# EAGLE design chujograj (EAGLE 8.2.2)
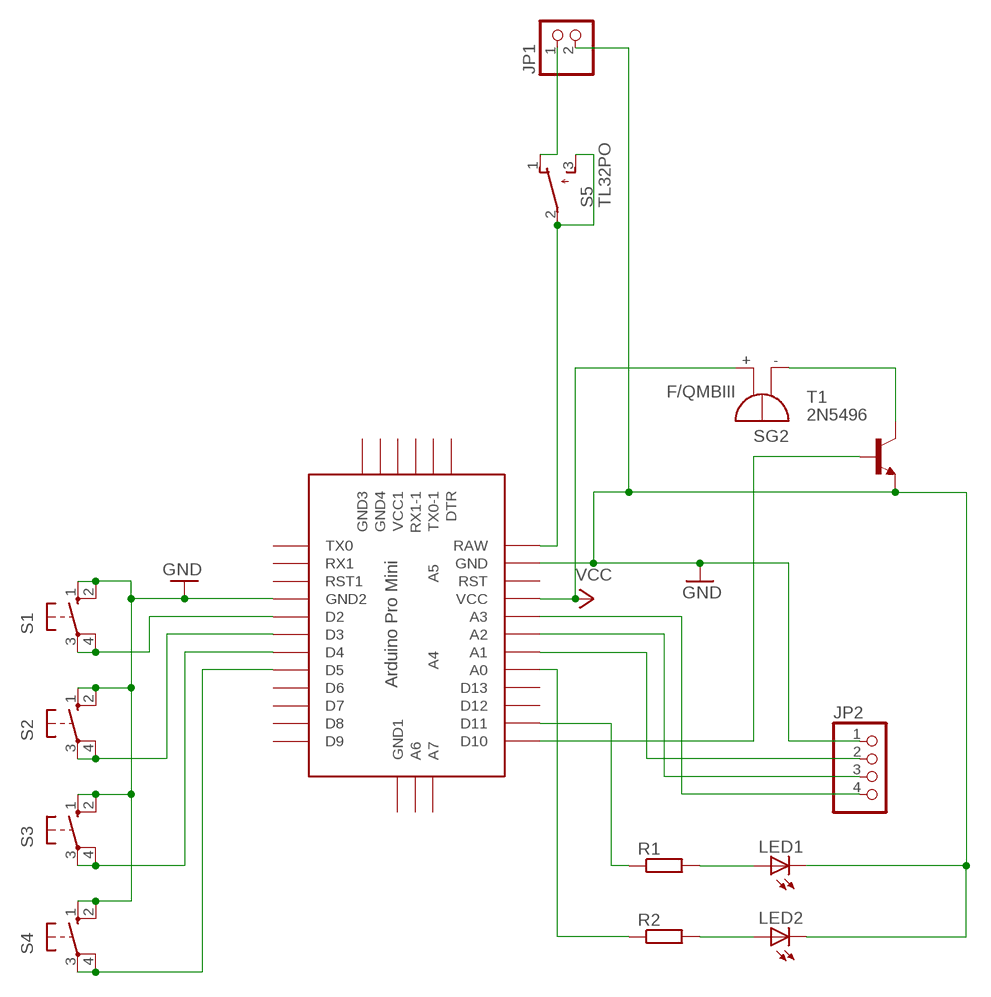
[diagram p0: schematic, sheet 1]

## Parts
JP1  PINHD-1X2  [1X02]
JP2  PINHD-1X4  [1X04]
LED1  LED5MM  [LED5MM]
LED2  LED5MM  [LED5MM]
R1  R-EU_0207/10  [0207/10]
R2  R-EU_0207/10  [0207/10]
S1  40-XX  [B3F-40XX]
S2  40-XX  [B3F-40XX]
S3  40-XX  [B3F-40XX]
S4  40-XX  [B3F-40XX]
S5  TL32PO  [TL3XPO]
SG2  F/QMBIII  [F/QMBIII]
T1  2N5496  [TO220]
U$1  ABK-PRO-MINI  [ABK-PRO-MINI]

## Nets
GND: JP1.2 JP2.1 LED1.K(C) LED2.K(C) S1.1(S) S1.2(S1) S2.1(S) S2.2(S1) S3.1(S) S3.2(S1) S4.1(S) S4.2(S1) T1.3(E) U$1.GND U$1.GND1(GND2)
N$2: S1.3(P) S1.4(P1) U$1.D2
N$3: S2.3(P) S2.4(P1) U$1.D3
N$4: S3.3(P) S3.4(P1) U$1.D4
N$5: S4.3(P) S4.4(P1) U$1.D5
N$7: SG2.-(+) T1.2(C)
N$8: T1.1(B) U$1.D10
N$10: JP2.2 U$1.A1
N$11: JP2.3 U$1.A2
N$12: JP2.4 U$1.A3
N$13: R1.1 U$1.D11
N$14: R2.1 U$1.A0
N$15: LED2.A R2.2
N$16: LED1.A R1.2
N$17: S5.2(P) S5.3(S) U$1.RAW
N$18: JP1.1 S5.1(O)
VCC: SG2.+(-) U$1.VCC
Unconnected: U$1.A4 U$1.A5 U$1.A6 U$1.A7 U$1.D6 U$1.D7 U$1.D8 U$1.D9 U$1.D12 U$1.D13 U$1.DTR U$1.GND2(GND3) U$1.GND3(GND4) U$1.GND4(GND1) U$1.RST U$1.RST1 U$1.RX1 U$1.RX1-1 U$1.TX0 U$1.TX0-1 U$1.VCC1

## Library data of the parts
JP1 = pinhead:PINHD-1X2: PIN HEADER
JP2 = pinhead:PINHD-1X4: PIN HEADER
LED1 LED2 = led:LED: LED OSRAM: - CHIPLED LG R971, LG N971, LY N971, LG Q971, LY Q971, LO R971, LY R971 LH N974, LH R974 LS Q976, LO Q976, LY Q976 LO Q996 - Hyper CHIPLED LW Q18S LB Q993, LB Q99A, LB R99A - SideLED LS A670, LO A670, LY A670, LG A670, LP A670 LB A673, LV A673, LT A673, LW A673 LH A674 LY A675 LS A676, LA A676, LO A676, LY A676, LW A676 LS A679, LY A679, LG A679 - Hyper Micro SIDELED® LS Y876, LA Y876, LO Y876, LY Y876 LT Y87S - SmartLED LW L88C, LW L88S LB L89C, LB L89S, LG L890 LS L89K, LO L89K, LY L89K LS L896, LA L896, LO L896, LY L896 - TOPLED LS T670, LO T670, LY T670, LG T670, LP T670 LSG T670, LSP T670, LSY T670, LOP T670, LYG T670 LG T671, LOG T671, LSG T671 LB T673, LV T673, LT T673, LW T673 LH T674 LS T676, LA T676, LO T676, LY T676, LB T676, LH T676, LSB T676, LW T676 LB T67C, LV T67C, LT T67C, LS T67K, LO T67K, LY T67K, LW E67C LS E67B, LA E67B, LO E67B, LY E67B, LB E67C, LV E67C, LT E67C LW T67C LS T679, LY T679, LG T679 LS T770, LO T770, LY T770, LG T770, LP T770 LB T773, LV T773, LT T773, LW T773 LH T774 LS E675, LA E675, LY E675, LS T675 LS T776, LA T776, LO T776, LY T776, LB T776 LHGB T686 LT T68C, LB T68C - Hyper Mini TOPLED® LB M676 - Mini TOPLED Santana® LG M470 LS M47K, LO M47K, LY M47K Source: http://www.osram.convergy.de LUXEON: - LUMILED® LXK2-PW12-R00, LXK2-PW12-S00, LXK2-PW14-U00, LXK2-PW14-V00 LXK2-PM12-R00, LXK2-PM12-S00, LXK2-PM14-U00 LXK2-PE12-Q00, LXK2-PE12-R00, LXK2-PE12-S00, LXK2-PE14-T00, LXK2-PE14-U00 LXK2-PB12-K00, LXK2-PB12-L00, LXK2-PB12-M00, LXK2-PB14-N00, LXK2-PB14-P00, LXK2-PB14-Q00 LXK2-PR12-L00, LXK2-PR12-M00, LXK2-PR14-Q00, LXK2-PR14-R00 LXK2-PD12-Q00, LXK2-PD12-R00, LXK2-PD12-S00 LXK2-PH12-R00, LXK2-PH12-S00 LXK2-PL12-P00, LXK2-PL12-Q00, LXK2-PL12-R00 Source: www.luxeon.com KINGBRIGHT: KA-3528ASYC Source: www.kingbright.com
R1 R2 = resistor:R-EU_: RESISTOR, European symbol
S1-S4 = switch-omron:40-XX: OMRON SWITCH; MF: OMRON COMPONENTS USA; MPN: B3F-4000; OC_FARNELL: 176434; OC_NEWARK: 36K3105
S5 = switch:TL32PO: TINY SWITCH ON - MOM Source: http://www2.produktinfo.conrad.com/datenblaetter/700000-724999/705152-da-01-de-Subminiaturschalter_TL_36YO.pdf
SG2 = buzzer:F/QMBIII: BUZZER Source: Buerklin; OC_FARNELL: unknown; OC_NEWARK: unknown
T1 = transistor-neu-to92:2N5496: NPN TRANSISTOR
U$1 = Arduino-clone:ABK-PRO-MINI: ABK Pro-Mini Arduino Clone

## Net classes
0 default: width 1 mm, drill 1 mm, clearance 1 mm

## Board
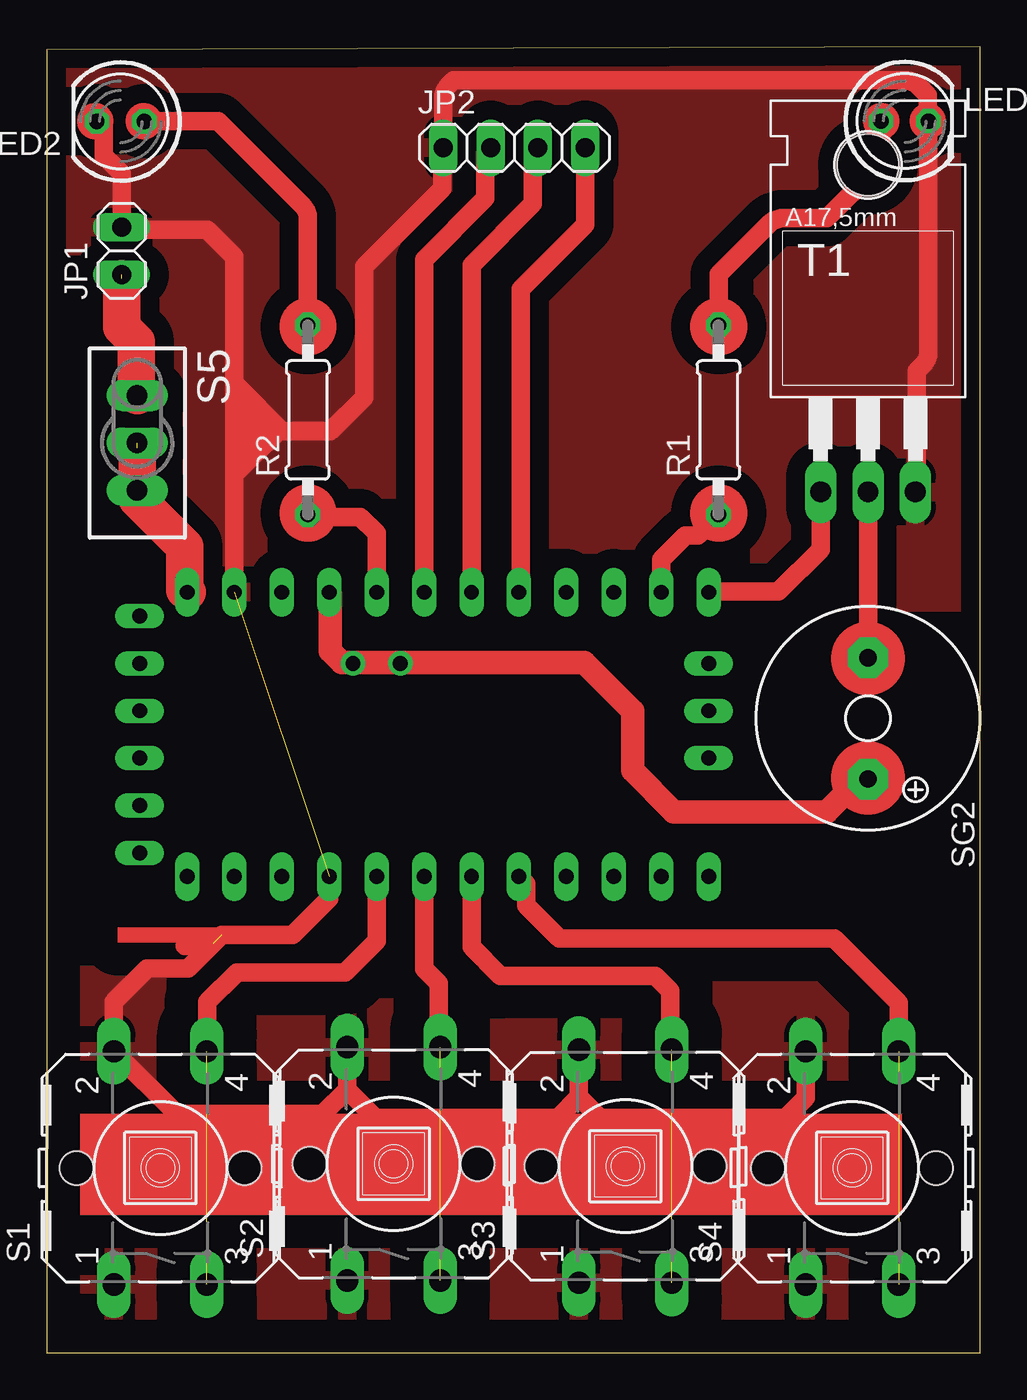
[diagram p1: board, top side]
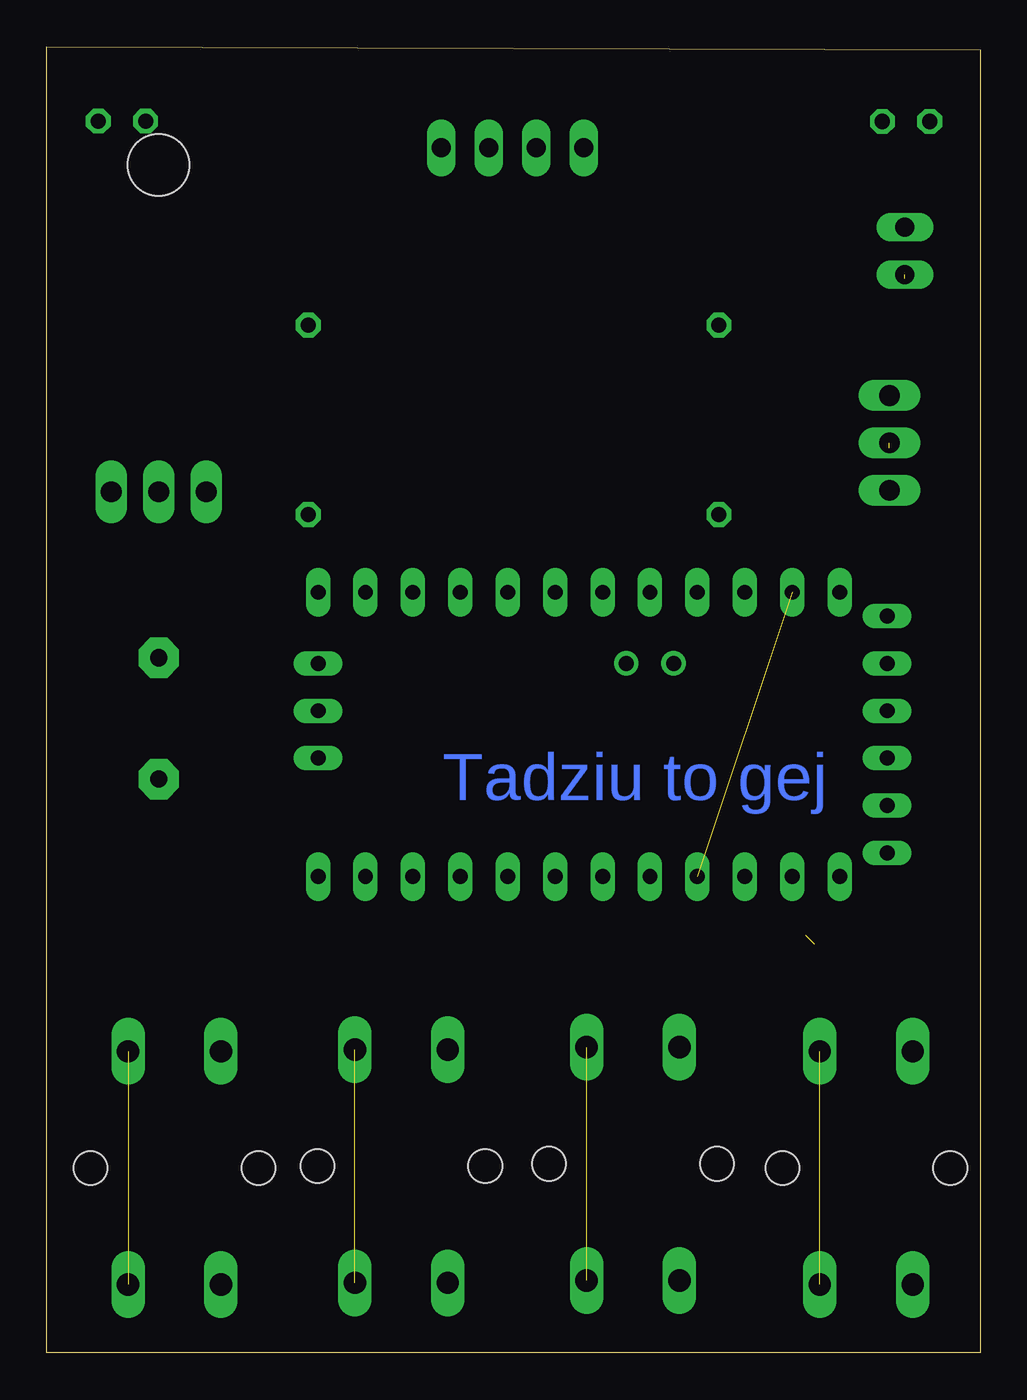
[diagram p2: board, bottom side, seen from below]

Size 50 x 70 mm. Coordinates in mm from the lower left corner, seen from the top.
Outline: 0,0 50,0 50,70 0,69.84 0,0
Copper layers (1*16): Top 0.035mm / dielectric 1.5mm / Bottom 0.035mm
Design rules "default": minimum track width 10mil, minimum drill 24mil, track to track 8mil, track to pad 8mil, pad to pad 8mil, via to via 8mil, smd to smd 8mil, copper to edge 40mil, drill to drill 8mil, minimum pad ring 10mil, minimum via ring 8mil, stop-mask expansion 4mil, vias tented up to drill 0mil, thermal gap 10mil

### Footprints (pad centres in the part's own frame; a part is rotated, then mirrored left to right if it is on the bottom)
1X02 = drill 1.016 long: 1 -1.27,0; 2 1.27,0
1X04 = drill 1.016 long: 1 -3.81,0; 2 -1.27,0; 3 1.27,0; 4 3.81,0
LED5MM = drill 0.813 octagon: A -1.27,0; K 1.27,0
0207/10 = drill 0.813 octagon: 1 -5.08,0; 2 5.08,0
B3F-40XX = drill 1.194 long: 1 -6.248,2.489; 2 6.248,2.489; 3 -6.248,-2.489; 4 6.248,-2.489 | hole 1.803: 0,-4.496; 0,4.496
TL3XPO = drill 1.1 pad 1.422 long: 1 -2.54,0; 2 0,0; 3 2.54,0
F/QMBIII = drill 0.914 pad 2.159 octagon: + 3.251,0; - -3.251,0
TO220 = drill 1.118 long: 1 -2.54,-6.35; 2 0,-6.35; 3 2.54,-6.35 | hole 3.302: 0,11.176
ABK-PRO-MINI = drill 0.8 long: A0 10.16,-3.81; A1 10.16,-6.35; A2 10.16,-8.89; A3 10.16,-11.43; A6 3.81,-21.59; A7 6.35,-21.59; D2 -5.08,-3.81; D3 -5.08,-6.35; D4 -5.08,-8.89; D5 -5.08,-11.43; D6 -5.08,-13.97; D7 -5.08,-16.51; D8 -5.08,-19.05; D9 -5.08,-21.59; D10 10.16,-21.59; D11 10.16,-19.05; D12 10.16,-16.51; D13 10.16,-13.97; DTR 8.89,8.89; GND 10.16,3.81; GND1 -5.08,-1.27; GND2 -3.81,8.89; GND3 -1.27,8.89; GND4 1.27,-21.59; RAW 10.16,6.35; RST 10.16,1.27; RST1 -5.08,1.27; RX1 -5.08,3.81; RX1-1 3.81,8.89; TX0 -5.08,6.35; TX0-1 6.35,8.89; VCC 10.16,-1.27; VCC1 1.27,8.89 | drill 0.8: A4 6.35,-5.08; A5 6.35,-2.54

### Placement (x,y rotation side)
JP1  4.02,59.06 90 top
JP2  25.05,64.58 0 top
LED1  45.97,66.01 0 top
LED2  3.96,65.99 180 top
R1  35.99,50 90 top
R2  13.99,50 90 top
S1  6.09,9.91 90 top
S2  18.59,10.13 90 top
S3  31,10 90 top
S4  43.15,9.91 90 top
S5  4.85,48.76 270 top
SG2  44,34 270 top
T1  44,52.49 0 top
U$1  13.87,30.6 90 top

### Tracks (layer width: path | path; a pad name or v marks a point on that pad's centre or on a via)
GND  (2 unrouted)
  Top 1: T1.3 arc45 46.6,46.28 46.6,52.6 46.95,52.95 arc45 47.24,53.65 LED1.K arc-45 47.2,66.11 47.2,67.4 46.69,67.91 arc45 45.99,68.2 21.8,68.2 21.53,67.93 arc45 21.24,67.23 JP2.1 arc45 21.2,64.48 21.2,62.4 17,58.2 17,51.2 15.2,49.4 12.6,49.4 | LED2.K 3.07,65.61 3.07,64.15 4.02,63.2 JP1.2 4.15,60.2 8.6,60.2 10.06,58.74 10.06,47.06 | 10.06,47.06 U$1.GND | 12.6,49.4 12.4,49.4 10.06,47.06 | 16.1,14.1 14.8,12.8 6.96,12.8 S1.2 3.6,18.8 5.4,20.6 7.57,20.6 9.37,22.4 13.18,22.4 15.14,24.36 U$1.GND1 | 16.1,14.1 S2.2 | 16.1,14.1 17.6,12.6 27.4,12.6 28.51,13.71 | 28.51,13.71 S3.2 | 28.51,13.71 29.62,12.6 39.6,12.6 40.66,13.66 S4.2 | 12.6,49.4 10.2,51.8 10.2,47.4 10.8,48 10.8,50.2 11.6,49.4 11.6,49.2 | 8.89,21.91 8.77,21.8 7.4,21.8
  pour Top (isolate 1.778): 21.8,22.4 1.8,22.4 0.2,20.8 0.2,0.2 0,0 50.2,0 50.2,21.6 49.2,22.6
  pour Top (isolate 1.016): 0,70 0,41.2 1,40.2 50.2,40.2 50,40.4 50,70 49.8,70.2 49.6,70
N$2  (1 unrouted)
  Top 1: S1.4 8.6,16.18 8.6,18.8 10.2,20.4 16,20.4 17.68,22.08 U$1.D2
N$3  (1 unrouted)
  Top 1: S2.4 21,16.46 21,19.8 20.22,20.58 U$1.D3
N$4  (1 unrouted)
  Top 1: S3.4 arc-45 33.4,16.46 33.4,19.4 32.6,20.2 24.31,20.2 22.76,21.75 U$1.D4
N$5  (1 unrouted)
  Top 1: U$1.D5 25.69,25.13 25.69,23.97 27.46,22.2 42.2,22.2 45.64,18.76 S4.4
N$7
  Top 1: SG2.- T1.2
N$8
  Top 1: U$1.D10 35.5,40.8 39.2,40.8 41.46,43.06 T1.1
N$10
  Top 1: JP2.2 23.5,64.3 23.5,61.87 20.22,58.59 U$1.A1
N$11
  Top 1: JP2.3 26.04,64.3 26.04,61.59 22.76,58.3 U$1.A2
N$12
  Top 1: U$1.A3 25.4,40.86 25.4,57 28.86,60.46 JP2.4
N$13
  Top 1: R1.1 34.87,43.8 34.2,43.8 32.92,42.52 U$1.D11
N$14
  Top 1: R2.1 14.11,44.8 16.8,44.8 17.68,43.92 U$1.A0
N$15
  Top 1: LED2.A arc-45 5.25,66 9.2,66 13.7,61.5 arc-45 13.99,60.8 R2.2
N$16
  Top 1: R1.2 arc45 36,55.1 36,57.8 38.71,60.51 arc-45 39.41,60.8 41.8,60.8 44.41,63.41 arc45 44.7,64.11 LED1.A
N$17  (1 unrouted)
  Top 2: U$1.RAW 7.4,40.88 7.4,43.2 4.85,45.75 S5.3 4.85,48.48
N$18  (1 unrouted)
  Top 2: S5.1 4.8,51.35 4.8,54.2 4.02,54.98 4.02,57.57
VCC
  Top 1.27: U$1.VCC 15.2,40.7 15.2,37.6 15.8,37 28.8,37 31.4,34.4 31.4,31.2 33.6,29 41.8,29 43.55,30.75 SG2.+
(copper drawn outside any net)
  shapes: Top area x2, Top circle x10

### Text on the board
Bottom: Tadziu to gej